# EAGLE schematic RF08-1 (EAGLE 6.6.0)

## Sheet 1 of 3
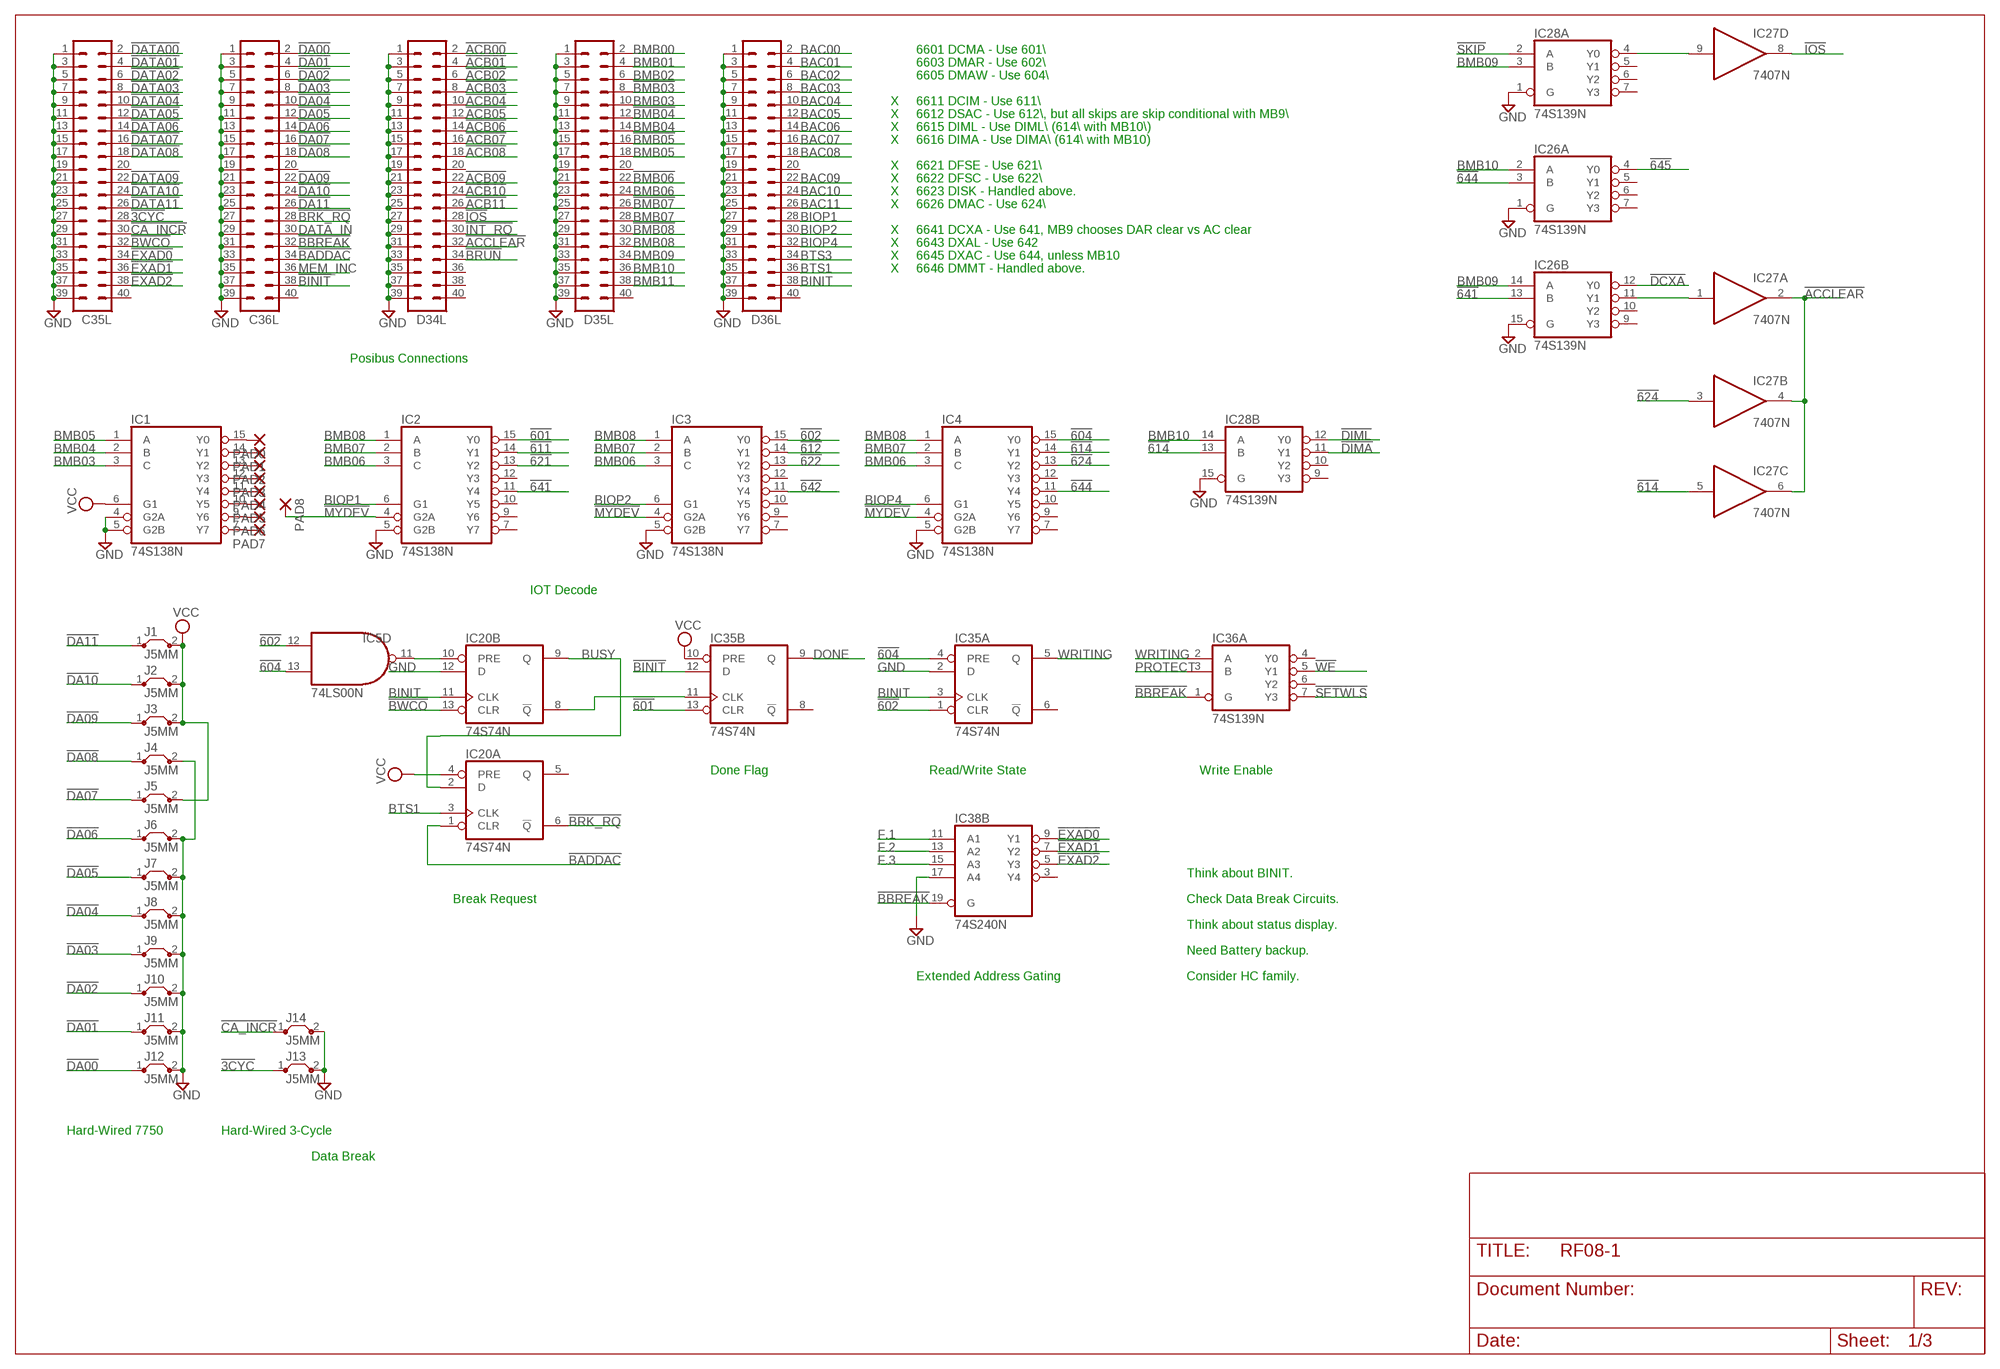
[diagram p0: schematic, sheet 1]

### Parts
C35L  MA20-2  [MA20-2]
C36L  MA20-2  [MA20-2]
D34L  MA20-2  [MA20-2]
D35L  MA20-2  [MA20-2]
D36L  MA20-2  [MA20-2]
IC1  74S138N  [DIL16]
IC2  74S138N  [DIL16]
IC3  74S138N  [DIL16]
IC4  74S138N  [DIL16]
IC5  74LS00N  [DIL14]
IC20  74S74N  [DIL14]
IC26  74S139N  [DIL16]
IC27  7407N  [DIL14]
IC28  74S139N  [DIL16]
IC35  74S74N  [DIL14]
IC36  74S139N  [DIL16]
IC38  74S240N  [DIL20]
J1  J5MM  [05]
J2  J5MM  [05]
J3  J5MM  [05]
J4  J5MM  [05]
J5  J5MM  [05]
J6  J5MM  [05]
J7  J5MM  [05]
J8  J5MM  [05]
J9  J5MM  [05]
J10  J5MM  [05]
J11  J5MM  [05]
J12  J5MM  [05]
J13  J5MM  [05]
J14  J5MM  [05]
PAD0  1,6/0,8  [1,6/0,8]
PAD1  1,6/0,8  [1,6/0,8]
PAD2  1,6/0,8  [1,6/0,8]
PAD3  1,6/0,8  [1,6/0,8]
PAD4  1,6/0,8  [1,6/0,8]
PAD5  1,6/0,8  [1,6/0,8]
PAD6  1,6/0,8  [1,6/0,8]
PAD7  1,6/0,8  [1,6/0,8]
PAD8  1,6/0,8  [1,6/0,8]

### Nets
!3CYC: C35L.28 J13.1
!601: IC2.15(Y0) IC35.13(B:CLR) ; also sheet 2
!602: IC3.15(Y0) IC5.12(D:I0) IC35.1(A:CLR) ; also sheet 2
!604: IC4.15(Y0) IC5.13(D:I1) IC35.4(A:PRE) ; also sheet 2
!611: IC2.14(Y1) ; also sheet 2
!612: IC3.14(Y1) ; also sheet 2
!614: IC4.14(Y1) IC27.5(C:I) IC28.13(B:B)
!621: IC2.13(Y2) ; also sheet 2
!622: IC3.13(Y2) ; also sheet 2
!624: IC4.13(Y2) IC27.3(B:I) ; also sheet 2
!641: IC2.11(Y4) IC26.13(B:B)
!642: IC3.11(Y4) ; also sheet 2
!644: IC4.11(Y4) IC26.3(A:B)
!645: IC26.4(A:Y0) ; also sheet 2
!ACB00: D34L.2 ; also sheet 2
!ACB01: D34L.4 ; also sheet 2
!ACB02: D34L.6 ; also sheet 2
!ACB03: D34L.8 ; also sheet 2
!ACB04: D34L.10 ; also sheet 2
!ACB05: D34L.12 ; also sheet 2
!ACB06: D34L.14 ; also sheet 2
!ACB07: D34L.16 ; also sheet 2
!ACB08: D34L.18 ; also sheet 2
!ACB09: D34L.22 ; also sheet 2
!ACB10: D34L.24 ; also sheet 2
!ACB11: D34L.26 ; also sheet 2
!ACCLEAR: D34L.32 IC27.2(A:O) IC27.4(B:O) IC27.6(C:O)
!BADDAC: C36L.34 IC20.1(A:CLR)
!BBREAK: C36L.32 IC36.1(A:G) IC38.19(B:G) ; also sheet 2,3
!BINIT: C36L.38 IC35.12(B:D)
!BMB03: D35L.8
!BMB04: D35L.12
!BMB05: D35L.16
!BMB06: D35L.22
!BMB07: D35L.26
!BMB08: D35L.30
!BRK_RQ: C36L.28 IC20.6(A:!Q)
!BRUN: D34L.34
!BWCO: C35L.32 IC20.13(B:CLR)
!CA_INCR: C35L.30 J14.1
!DA00: C36L.2 J12.1
!DA01: C36L.4 J11.1
!DA02: C36L.6 J10.1
!DA03: C36L.8 J9.1
!DA04: C36L.10 J8.1
!DA05: C36L.12 J7.1
!DA06: C36L.14 J6.1
!DA07: C36L.16 J5.1
!DA08: C36L.18 J4.1
!DA09: C36L.22 J3.1
!DA10: C36L.24 J2.1
!DA11: C36L.26 J1.1
!DATA00: C35L.2 ; also sheet 3
!DATA01: C35L.4 ; also sheet 3
!DATA02: C35L.6 ; also sheet 3
!DATA03: C35L.8 ; also sheet 3
!DATA04: C35L.10 ; also sheet 3
!DATA05: C35L.12 ; also sheet 3
!DATA06: C35L.14 ; also sheet 3
!DATA07: C35L.16 ; also sheet 3
!DATA08: C35L.18 ; also sheet 3
!DATA09: C35L.22 ; also sheet 3
!DATA10: C35L.24 ; also sheet 3
!DATA11: C35L.26 ; also sheet 3
!DCXA: IC26.12(B:Y0) ; also sheet 2
!DIMA: IC28.11(B:Y1) ; also sheet 2
!DIML: IC28.12(B:Y0) ; also sheet 2
!EXAD0: C35L.34 IC38.9(B:Y1)
!EXAD1: C35L.36 IC38.7(B:Y2)
!EXAD2: C35L.38 IC38.5(B:Y3)
!INT_RQ: D34L.30 ; also sheet 2
!IOS: D34L.28 IC27.8(D:O)
!MYDEV: IC2.4(G2A) IC3.4(G2A) IC4.4(G2A) PAD8.1(P)
!SETWLS: IC36.7(A:Y3) ; also sheet 2
!SKIP: IC28.2(A:A) ; also sheet 2
!WE: IC36.5(A:Y1) ; also sheet 3
BAC00: D36L.2 ; also sheet 2
BAC01: D36L.4 ; also sheet 2
BAC02: D36L.6 ; also sheet 2
BAC03: D36L.8 ; also sheet 2
BAC04: D36L.10 ; also sheet 2
BAC05: D36L.12 ; also sheet 2
BAC06: D36L.14 ; also sheet 2
BAC07: D36L.16 ; also sheet 2
BAC08: D36L.18 ; also sheet 2
BAC09: D36L.22 ; also sheet 2
BAC10: D36L.24 ; also sheet 2
BAC11: D36L.26 ; also sheet 2
BINIT: D36L.38 IC20.11(B:CLK) IC35.3(A:CLK) ; also sheet 2
BIOP1: D36L.28 IC2.6(G1)
BIOP2: D36L.30 IC3.6(G1)
BIOP4: D36L.32 IC4.6(G1)
BMB00: D35L.2 ; also sheet 3
BMB01: D35L.4 ; also sheet 3
BMB02: D35L.6 ; also sheet 3
BMB03: D35L.10 IC1.3(C) ; also sheet 3
BMB04: D35L.14 IC1.2(B) ; also sheet 3
BMB05: D35L.18 IC1.1(A) ; also sheet 3
BMB06: D35L.24 IC2.3(C) IC3.3(C) IC4.3(C) ; also sheet 3
BMB07: D35L.28 IC2.2(B) IC3.2(B) IC4.2(B) ; also sheet 3
BMB08: D35L.32 IC2.1(A) IC3.1(A) IC4.1(A) ; also sheet 3
BMB09: D35L.34 IC26.14(B:A) IC28.3(A:B) ; also sheet 3
BMB10: D35L.36 IC26.2(A:A) IC28.14(B:A) ; also sheet 3
BMB11: D35L.38 ; also sheet 3
BTS1: D36L.36 IC20.3(A:CLK)
BTS3: D36L.34
BUSY: IC20.2(A:D) IC20.9(B:Q) ; also sheet 2
DATA_IN: C36L.30
DONE: IC35.9(B:Q) ; also sheet 2
F.1: IC38.11(B:A1) ; also sheet 2
F.2: IC38.13(B:A2) ; also sheet 2
F.3: IC38.15(B:A3) ; also sheet 2
GND [Power]: C35L.1 C35L.3 C35L.5 C35L.7 C35L.9 C35L.11 C35L.13 C35L.15 C35L.17 C35L.19 C35L.21 C35L.23 C35L.25 C35L.27 C35L.29 C35L.31 C35L.33 C35L.35 C35L.37 C35L.39 C36L.1 C36L.3 C36L.5 C36L.7 C36L.9 C36L.11 C36L.13 C36L.15 C36L.17 C36L.19 C36L.21 C36L.23 C36L.25 C36L.27 C36L.29 C36L.31 C36L.33 C36L.35 C36L.37 C36L.39 D34L.1 D34L.3 D34L.5 D34L.7 D34L.9 D34L.11 D34L.13 D34L.15 D34L.17 D34L.19 D34L.21 D34L.23 D34L.25 D34L.27 D34L.29 D34L.31 D34L.33 D34L.35 D34L.37 D34L.39 D35L.1 D35L.3 D35L.5 D35L.7 D35L.9 D35L.11 D35L.13 D35L.15 D35L.17 D35L.19 D35L.21 D35L.23 D35L.25 D35L.27 D35L.29 D35L.31 D35L.33 D35L.35 D35L.37 D35L.39 D36L.1 D36L.3 D36L.5 D36L.7 D36L.9 D36L.11 D36L.13 D36L.15 D36L.17 D36L.19 D36L.21 D36L.23 D36L.25 D36L.27 D36L.29 D36L.31 D36L.33 D36L.35 D36L.37 D36L.39 IC1.4(G2A) IC1.5(G2B) IC2.5(G2B) IC3.5(G2B) IC4.5(G2B) IC20.12(B:D) IC26.1(A:G) IC26.15(B:G) IC28.1(A:G) IC28.15(B:G) IC35.2(A:D) IC38.17(B:A4) J4.2 J6.2 J7.2 J8.2 J9.2 J10.2 J11.2 J12.2 J13.2 J14.2 ; also sheet 2,3
MEM_INC: C36L.36
N$1: IC1.9(Y6) PAD6.1(P)
N$2: IC20.8(B:!Q) IC35.11(B:CLK)
N$5: IC1.15(Y0) PAD0.1(P)
N$6: IC1.14(Y1) PAD1.1(P)
N$7: IC1.13(Y2) PAD2.1(P)
N$8: IC1.12(Y3) PAD3.1(P)
N$9: IC1.11(Y4) PAD4.1(P)
N$10: IC1.10(Y5) PAD5.1(P)
N$11: IC1.7(Y7) PAD7.1(P)
N$26: IC26.11(B:Y1) IC27.1(A:I)
N$27: IC27.9(D:I) IC28.4(A:Y0)
N$31: IC5.11(D:O) IC20.10(B:PRE)
PROTECT: IC36.3(A:B) ; also sheet 3
VCC [Power]: IC1.6(G1) IC20.4(A:PRE) IC35.10(B:PRE) J1.2 J2.2 J3.2 J5.2 ; also sheet 2,3
WRITING: IC35.5(A:Q) IC36.2(A:A) ; also sheet 3
Unconnected: C35L.20 C35L.40 C36L.20 C36L.40 D34L.20 D34L.36 D34L.38 D34L.40 D35L.20 D35L.40 D36L.20 D36L.40 IC2.7(Y7) IC2.9(Y6) IC2.10(Y5) IC2.12(Y3) IC3.7(Y7) IC3.9(Y6) IC3.10(Y5) IC3.12(Y3) IC4.7(Y7) IC4.9(Y6) IC4.10(Y5) IC4.12(Y3) IC20.5(A:Q) IC26.5(A:Y1) IC26.6(A:Y2) IC26.7(A:Y3) IC26.9(B:Y3) IC26.10(B:Y2) IC27.10(E:O) IC27.11(E:I) IC27.12(F:O) IC27.13(F:I) IC28.5(A:Y1) IC28.6(A:Y2) IC28.7(A:Y3) IC28.9(B:Y3) IC28.10(B:Y2) IC35.6(A:!Q) IC35.8(B:!Q) IC36.4(A:Y0) IC36.6(A:Y2) IC36.9(B:Y3) IC36.10(B:Y2) IC36.11(B:Y1) IC36.12(B:Y0) IC36.13(B:B) IC36.14(B:A) IC36.15(B:G) IC38.1(A:G) IC38.2(A:A1) IC38.3(B:Y4) IC38.4(A:A2) IC38.6(A:A3) IC38.8(A:A4) IC38.12(A:Y4) IC38.14(A:Y3) IC38.16(A:Y2) IC38.18(A:Y1)

### Notes on the sheet
- 6601 DCMA - Use 601\\
- 6603 DMAR - Use 602\\
- 6605 DMAW - Use 604\\
- X | 6611 DCIM - Use 611\\
- X | 6612 DSAC - Use 612\\, but all skips are skip conditional with MB9\\
- X | 6615 DIML - Use DIML\\ (614\\ with MB10\\)
- X | 6616 DIMA - Use DIMA\\ (614\\ with MB10)
- X | 6621 DFSE - Use 621\\
- X | 6622 DFSC - Use 622\\
- X | 6623 DISK - Handled above.
- X | 6626 DMAC - Use 624\\
- X | 6641 DCXA - Use 641, MB9 chooses DAR clear vs AC clear
- X | 6643 DXAL - Use 642
- X | 6645 DXAC - Use 644, unless MB10
- X | 6646 DMMT - Handled above.
- Posibus Connections
- IOT Decode
- Done Flag | Read/Write State | Write Enable
- Think about BINIT.
- Break Request | Check Data Break Circuits.
- Think about status display.
- Need Battery backup.
- Extended Address Gating | Consider HC family.
- Hard-Wired 7750 | Hard-Wired 3-Cycle
- Data Break

## Sheet 2 of 3
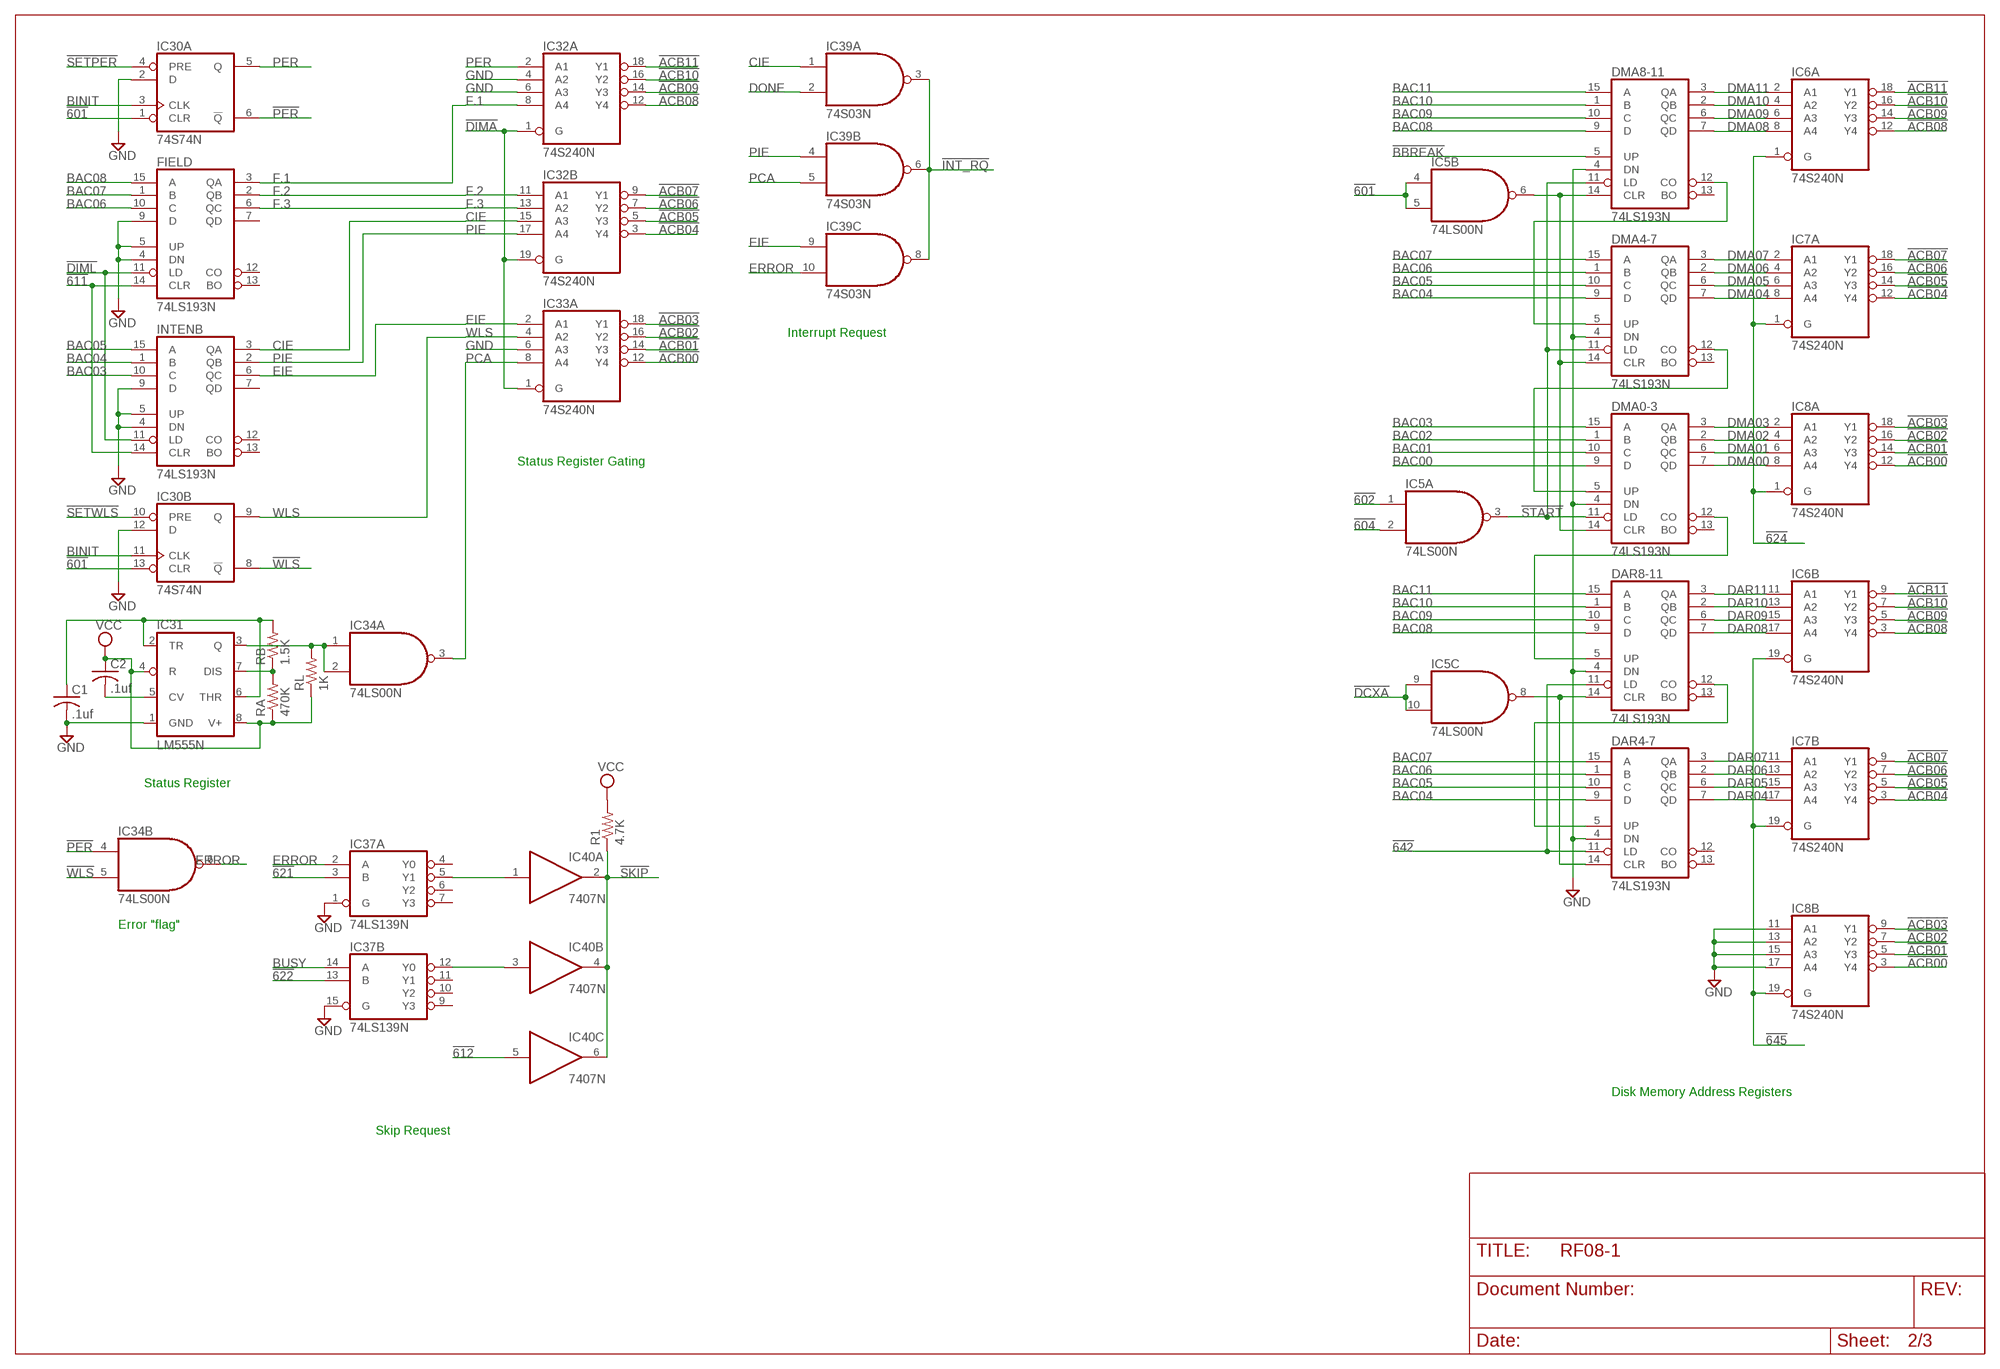
[diagram p1: schematic, sheet 2]

### Parts
C1  .1uf  C-US050-025X075  [C050-025X075]
C2  .1uf  C-US050-025X075  [C050-025X075]
DAR4-7  74LS193N  74LS192N  [DIL16]
DAR8-11  74LS193N  74LS192N  [DIL16]
DMA0-3  74LS193N  74LS192N  [DIL16]
DMA4-7  74LS193N  74LS192N  [DIL16]
DMA8-11  74LS193N  74LS192N  [DIL16]
FIELD  74LS193N  74LS192N  [DIL16]
IC6  74S240N  [DIL20]
IC7  74S240N  [DIL20]
IC8  74S240N  [DIL20]
IC30  74S74N  [DIL14]
IC31  LM555N  [DIL08]
IC32  74S240N  [DIL20]
IC33  74S240N  [DIL20]
IC34  74LS00N  [DIL14]
IC37  74LS139N  [DIL16]
IC39  74S03N  [DIL14]
IC40  7407N  [DIL14]
INTENB  74LS193N  74LS192N  [DIL16]
R1  4.7K  R-US_0207/10  [0207/10]
RA  470K  R-US_0207/10  [0207/10]
RB  1.5K  R-US_0207/10  [0207/10]
RL  1K  R-US_0207/10  [0207/10]

### Nets
!601: IC5.4(B:I0) IC5.5(B:I1) IC30.1(A:CLR) IC30.13(B:CLR) ; also sheet 1
!602: IC5.1(A:I0) ; also sheet 1
!604: IC5.2(A:I1) ; also sheet 1
!611: FIELD.14(CLR) INTENB.14(CLR) ; also sheet 1
!612: IC40.5(C:I) ; also sheet 1
!621: IC37.3(A:B) ; also sheet 1
!622: IC37.13(B:B) ; also sheet 1
!624: IC6.1(A:G) IC7.1(A:G) IC8.1(A:G) ; also sheet 1
!642: DAR4-7.11(LD) DAR8-11.11(LD) ; also sheet 1
!645: IC6.19(B:G) IC7.19(B:G) IC8.19(B:G) ; also sheet 1
!ACB00: IC8.3(B:Y4) IC8.12(A:Y4) IC33.12(A:Y4) ; also sheet 1
!ACB01: IC8.5(B:Y3) IC8.14(A:Y3) IC33.14(A:Y3) ; also sheet 1
!ACB02: IC8.7(B:Y2) IC8.16(A:Y2) IC33.16(A:Y2) ; also sheet 1
!ACB03: IC8.9(B:Y1) IC8.18(A:Y1) IC33.18(A:Y1) ; also sheet 1
!ACB04: IC7.3(B:Y4) IC7.12(A:Y4) IC32.3(B:Y4) ; also sheet 1
!ACB05: IC7.5(B:Y3) IC7.14(A:Y3) IC32.5(B:Y3) ; also sheet 1
!ACB06: IC7.7(B:Y2) IC7.16(A:Y2) IC32.7(B:Y2) ; also sheet 1
!ACB07: IC7.9(B:Y1) IC7.18(A:Y1) IC32.9(B:Y1) ; also sheet 1
!ACB08: IC6.3(B:Y4) IC6.12(A:Y4) IC32.12(A:Y4) ; also sheet 1
!ACB09: IC6.5(B:Y3) IC6.14(A:Y3) IC32.14(A:Y3) ; also sheet 1
!ACB10: IC6.7(B:Y2) IC6.16(A:Y2) IC32.16(A:Y2) ; also sheet 1
!ACB11: IC6.9(B:Y1) IC6.18(A:Y1) IC32.18(A:Y1) ; also sheet 1
!BBREAK: DMA8-11.5(UP) ; also sheet 1,3
!DCXA: IC5.9(C:I0) IC5.10(C:I1) ; also sheet 1
!DIMA: IC32.1(A:G) IC32.19(B:G) IC33.1(A:G) ; also sheet 1
!DIML: FIELD.11(LD) INTENB.11(LD) ; also sheet 1
!INT_RQ: IC39.3(A:O) IC39.6(B:O) IC39.8(C:O) ; also sheet 1
!PER: IC30.6(A:!Q) IC34.4(B:I0)
!SETPER: IC30.4(A:PRE) ; also sheet 3
!SETWLS: IC30.10(B:PRE) ; also sheet 1
!SKIP: IC40.2(A:O) IC40.4(B:O) IC40.6(C:O) R1.1 ; also sheet 1
!START: DMA0-3.11(LD) DMA4-7.11(LD) DMA8-11.11(LD) IC5.3(A:O)
!WLS: IC30.8(B:!Q) IC34.5(B:I1)
BAC00: DMA0-3.9(D) ; also sheet 1
BAC01: DMA0-3.10(C) ; also sheet 1
BAC02: DMA0-3.1(B) ; also sheet 1
BAC03: DMA0-3.15(A) INTENB.10(C) ; also sheet 1
BAC04: DAR4-7.9(D) DMA4-7.9(D) INTENB.1(B) ; also sheet 1
BAC05: DAR4-7.10(C) DMA4-7.10(C) INTENB.15(A) ; also sheet 1
BAC06: DAR4-7.1(B) DMA4-7.1(B) FIELD.10(C) ; also sheet 1
BAC07: DAR4-7.15(A) DMA4-7.15(A) FIELD.1(B) ; also sheet 1
BAC08: DAR8-11.9(D) DMA8-11.9(D) FIELD.15(A) ; also sheet 1
BAC09: DAR8-11.10(C) DMA8-11.10(C) ; also sheet 1
BAC10: DAR8-11.1(B) DMA8-11.1(B) ; also sheet 1
BAC11: DAR8-11.15(A) DMA8-11.15(A) ; also sheet 1
BINIT: IC30.3(A:CLK) IC30.11(B:CLK) ; also sheet 1
BUSY: IC37.14(B:A) ; also sheet 1
CIE: IC32.15(B:A3) IC39.1(A:I0) INTENB.3(QA)
DAR04: DAR4-7.7(QD) IC7.17(B:A4) ; also sheet 3
DAR05: DAR4-7.6(QC) IC7.15(B:A3) ; also sheet 3
DAR06: DAR4-7.2(QB) IC7.13(B:A2) ; also sheet 3
DAR07: DAR4-7.3(QA) IC7.11(B:A1) ; also sheet 3
DAR08: DAR8-11.7(QD) IC6.17(B:A4) ; also sheet 3
DAR09: DAR8-11.6(QC) IC6.15(B:A3) ; also sheet 3
DAR10: DAR8-11.2(QB) IC6.13(B:A2) ; also sheet 3
DAR11: DAR8-11.3(QA) IC6.11(B:A1) ; also sheet 3
DMA00: DMA0-3.7(QD) IC8.8(A:A4) ; also sheet 3
DMA01: DMA0-3.6(QC) IC8.6(A:A3) ; also sheet 3
DMA02: DMA0-3.2(QB) IC8.4(A:A2) ; also sheet 3
DMA03: DMA0-3.3(QA) IC8.2(A:A1) ; also sheet 3
DMA04: DMA4-7.7(QD) IC7.8(A:A4) ; also sheet 3
DMA05: DMA4-7.6(QC) IC7.6(A:A3) ; also sheet 3
DMA06: DMA4-7.2(QB) IC7.4(A:A2) ; also sheet 3
DMA07: DMA4-7.3(QA) IC7.2(A:A1) ; also sheet 3
DMA08: DMA8-11.7(QD) IC6.8(A:A4) ; also sheet 3
DMA09: DMA8-11.6(QC) IC6.6(A:A3) ; also sheet 3
DMA10: DMA8-11.2(QB) IC6.4(A:A2) ; also sheet 3
DMA11: DMA8-11.3(QA) IC6.2(A:A1) ; also sheet 3
DONE: IC39.2(A:I1) ; also sheet 1
EIE: IC33.2(A:A1) IC39.9(C:I0) INTENB.6(QC)
ERROR: IC34.6(B:O) IC37.2(A:A) IC39.10(C:I1)
F.1: FIELD.3(QA) IC32.8(A:A4) ; also sheet 1
F.2: FIELD.2(QB) IC32.11(B:A1) ; also sheet 1
F.3: FIELD.6(QC) IC32.13(B:A2) ; also sheet 1
GND [Power]: C1.2 DAR4-7.4(DN) DAR8-11.4(DN) DMA0-3.4(DN) DMA4-7.4(DN) DMA8-11.4(DN) FIELD.4(DN) FIELD.5(UP) FIELD.9(D) IC8.11(B:A1) IC8.13(B:A2) IC8.15(B:A3) IC8.17(B:A4) IC30.2(A:D) IC30.12(B:D) IC31.1(GND) IC32.4(A:A2) IC32.6(A:A3) IC33.6(A:A3) IC37.1(A:G) IC37.15(B:G) INTENB.4(DN) INTENB.5(UP) INTENB.9(D) ; also sheet 1,3
N$3: DMA0-3.5(UP) DMA4-7.12(CO)
N$12: DAR4-7.14(CLR) DAR8-11.14(CLR) IC5.8(C:O)
N$13: DMA4-7.5(UP) DMA8-11.12(CO)
N$16: DAR8-11.5(UP) DMA0-3.12(CO)
N$22: DMA0-3.14(CLR) DMA4-7.14(CLR) DMA8-11.14(CLR) IC5.6(B:O)
N$25: DAR4-7.5(UP) DAR8-11.12(CO)
N$28: IC37.5(A:Y1) IC40.1(A:I)
N$29: IC31.7(DIS) RA.2 RB.1
N$30: IC31.3(Q) IC34.1(A:I0) IC34.2(A:I1) RL.2
N$32: C1.1 IC31.2(TR) IC31.6(THR) RB.2
N$33: IC37.12(B:Y0) IC40.3(B:I)
N$34: C2.2 IC31.5(CV)
PCA: IC33.8(A:A4) IC34.3(A:O) IC39.5(B:I1)
PER: IC30.5(A:Q) IC32.2(A:A1)
PIE: IC32.17(B:A4) IC39.4(B:I0) INTENB.2(QB)
VCC [Power]: C2.1 IC31.4(R) IC31.8(V+) R1.2 RA.1 RL.1 ; also sheet 1,3
WLS: IC30.9(B:Q) IC33.4(A:A2)
Unconnected: DAR4-7.12(CO) DAR4-7.13(BO) DAR8-11.13(BO) DMA0-3.13(BO) DMA4-7.13(BO) DMA8-11.13(BO) FIELD.7(QD) FIELD.12(CO) FIELD.13(BO) IC33.3(B:Y4) IC33.5(B:Y3) IC33.7(B:Y2) IC33.9(B:Y1) IC33.11(B:A1) IC33.13(B:A2) IC33.15(B:A3) IC33.17(B:A4) IC33.19(B:G) IC34.8(C:O) IC34.9(C:I0) IC34.10(C:I1) IC34.11(D:O) IC34.12(D:I0) IC34.13(D:I1) IC37.4(A:Y0) IC37.6(A:Y2) IC37.7(A:Y3) IC37.9(B:Y3) IC37.10(B:Y2) IC37.11(B:Y1) IC39.11(D:O) IC39.12(D:I0) IC39.13(D:I1) IC40.8(D:O) IC40.9(D:I) IC40.10(E:O) IC40.11(E:I) IC40.12(F:O) IC40.13(F:I) INTENB.7(QD) INTENB.12(CO) INTENB.13(BO)

### Notes on the sheet
- Interrupt Request
- Status Register Gating
- Status Register
- Error "flag"
- Disk Memory Address Registers
- Skip Request

## Sheet 3 of 3
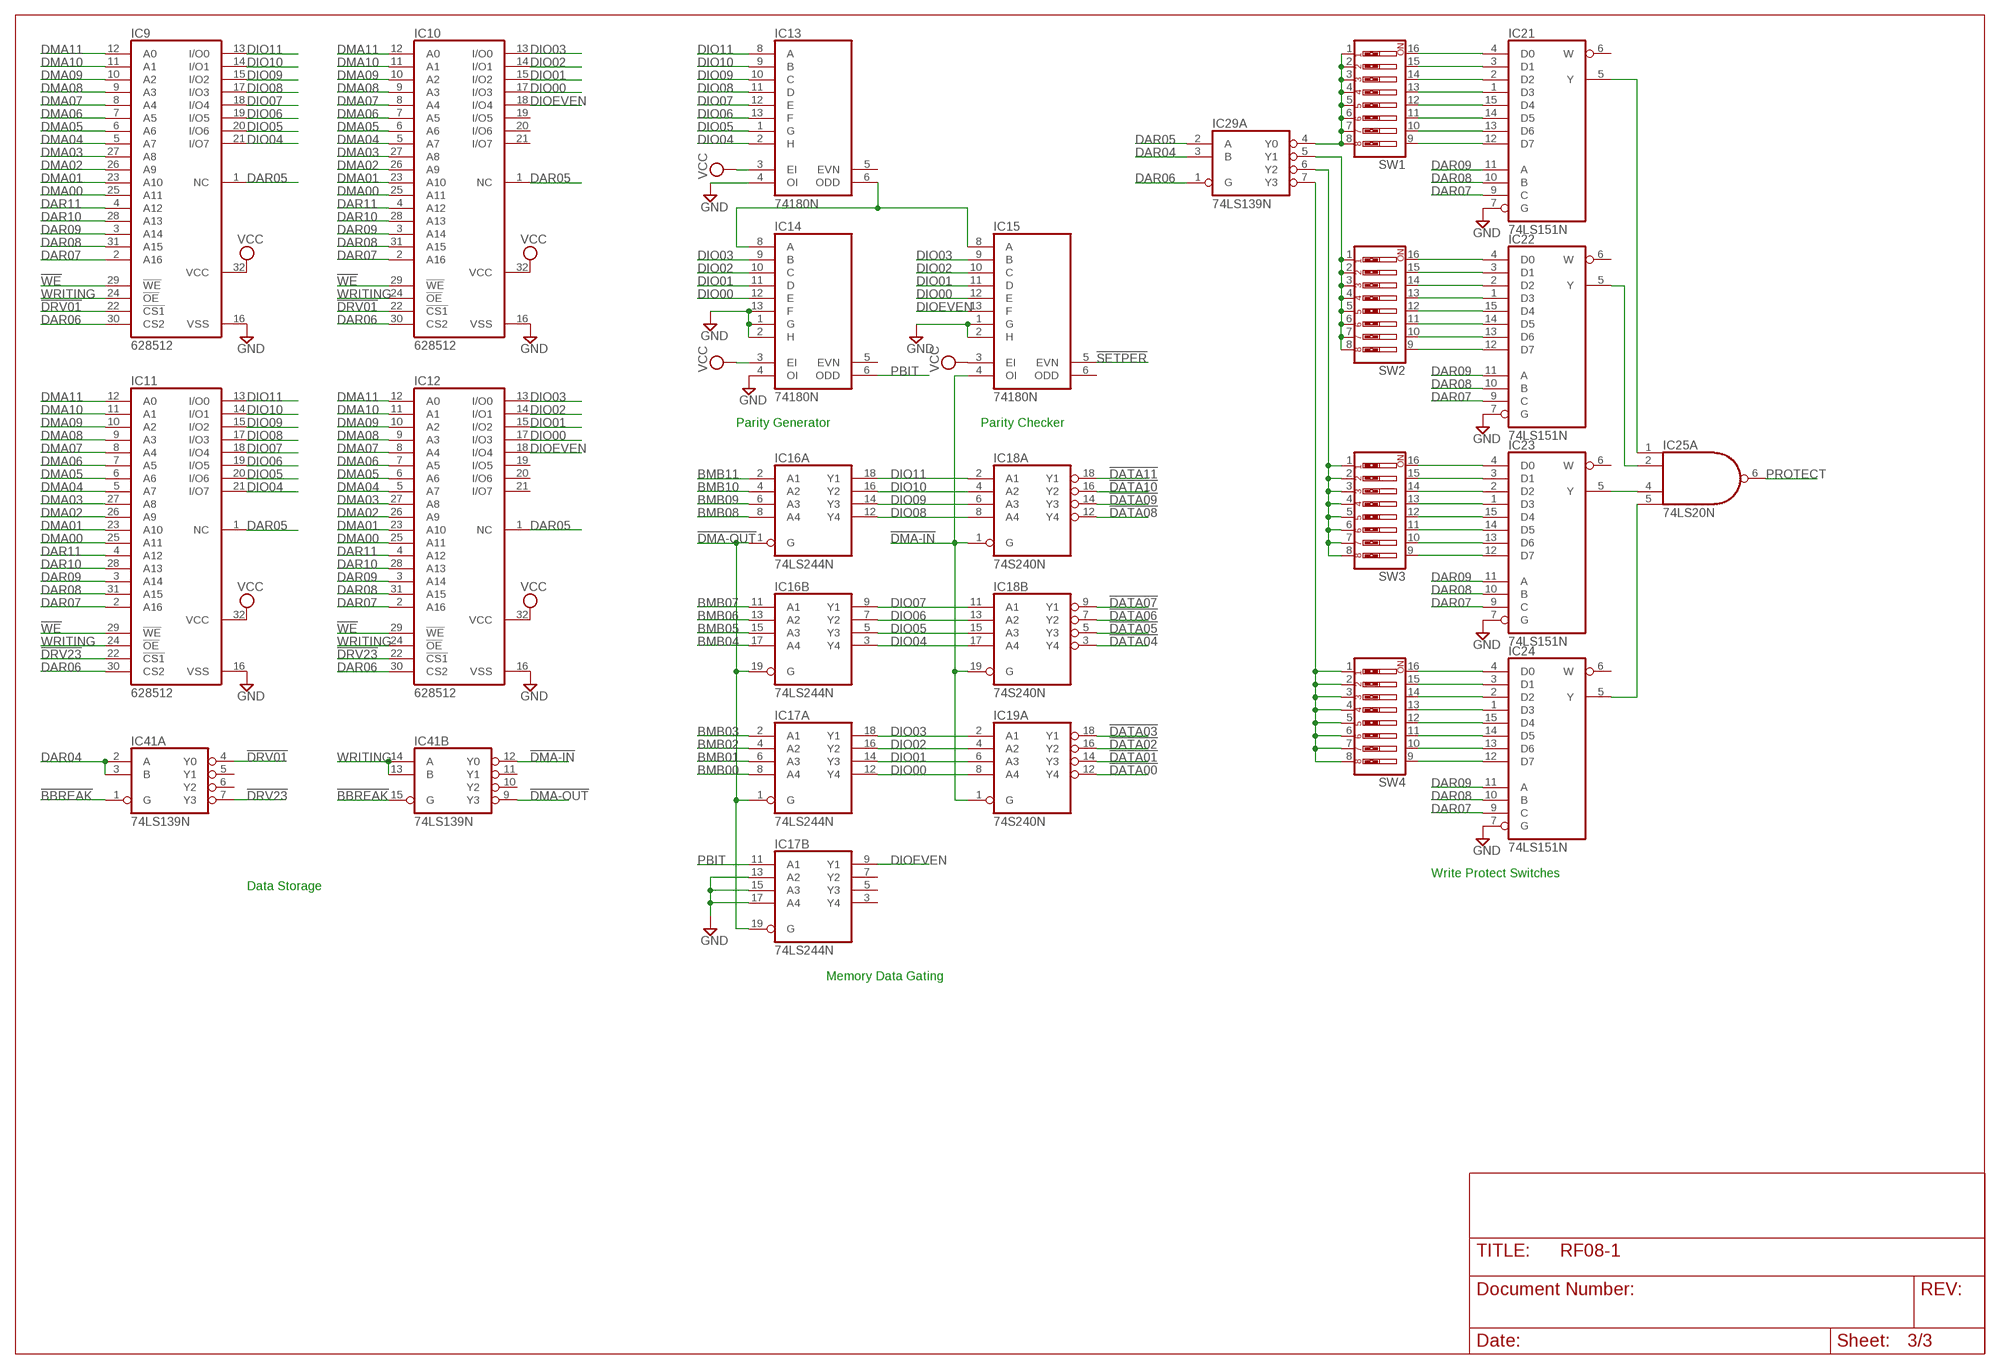
[diagram p2: schematic, sheet 3]

### Parts
IC9  628512  628128P  [DIL32]
IC10  628512  628128P  [DIL32]
IC11  628512  628128P  [DIL32]
IC12  628512  628128P  [DIL32]
IC13  74180N  [DIL14]
IC14  74180N  [DIL14]
IC15  74180N  [DIL14]
IC16  74LS244N  [DIL20]
IC17  74LS244N  [DIL20]
IC18  74S240N  [DIL20]
IC19  74S240N  [DIL20]
IC21  74LS151N  [DIL16]
IC22  74LS151N  [DIL16]
IC23  74LS151N  [DIL16]
IC24  74LS151N  [DIL16]
IC25  74LS20N  [DIL14]
IC29  74LS139N  [DIL16]
IC41  74LS139N  [DIL16]
SW1  SW_DIP-8  [EDG-08]
SW2  SW_DIP-8  [EDG-08]
SW3  SW_DIP-8  [EDG-08]
SW4  SW_DIP-8  [EDG-08]

### Nets
!BBREAK: IC41.1(A:G) IC41.15(B:G) ; also sheet 1,2
!DATA00: IC19.12(A:Y4) ; also sheet 1
!DATA01: IC19.14(A:Y3) ; also sheet 1
!DATA02: IC19.16(A:Y2) ; also sheet 1
!DATA03: IC19.18(A:Y1) ; also sheet 1
!DATA04: IC18.3(B:Y4) ; also sheet 1
!DATA05: IC18.5(B:Y3) ; also sheet 1
!DATA06: IC18.7(B:Y2) ; also sheet 1
!DATA07: IC18.9(B:Y1) ; also sheet 1
!DATA08: IC18.12(A:Y4) ; also sheet 1
!DATA09: IC18.14(A:Y3) ; also sheet 1
!DATA10: IC18.16(A:Y2) ; also sheet 1
!DATA11: IC18.18(A:Y1) ; also sheet 1
!DMA-IN: IC15.4(OI) IC18.1(A:G) IC18.19(B:G) IC19.1(A:G) IC41.12(B:Y0)
!DMA-OUT: IC16.1(A:G) IC16.19(B:G) IC17.1(A:G) IC17.19(B:G) IC41.9(B:Y3)
!DRV01: IC9.22(!CS1) IC10.22(!CS1) IC41.4(A:Y0)
!DRV23: IC11.22(!CS1) IC12.22(!CS1) IC41.7(A:Y3)
!SETPER: IC15.5(EVN) ; also sheet 2
!WE: IC9.29(!WE) IC10.29(!WE) IC11.29(!WE) IC12.29(!WE) ; also sheet 1
BMB00: IC17.8(A:A4) ; also sheet 1
BMB01: IC17.6(A:A3) ; also sheet 1
BMB02: IC17.4(A:A2) ; also sheet 1
BMB03: IC17.2(A:A1) ; also sheet 1
BMB04: IC16.17(B:A4) ; also sheet 1
BMB05: IC16.15(B:A3) ; also sheet 1
BMB06: IC16.13(B:A2) ; also sheet 1
BMB07: IC16.11(B:A1) ; also sheet 1
BMB08: IC16.8(A:A4) ; also sheet 1
BMB09: IC16.6(A:A3) ; also sheet 1
BMB10: IC16.4(A:A2) ; also sheet 1
BMB11: IC16.2(A:A1) ; also sheet 1
DAR04: IC29.3(A:B) IC41.2(A:A) IC41.3(A:B) ; also sheet 2
DAR05: IC9.1(NC) IC10.1(NC) IC11.1(NC) IC12.1(NC) IC29.2(A:A) ; also sheet 2
DAR06: IC9.30(CS2) IC10.30(CS2) IC11.30(CS2) IC12.30(CS2) IC29.1(A:G) ; also sheet 2
DAR07: IC9.2(A16) IC10.2(A16) IC11.2(A16) IC12.2(A16) IC21.9(C) IC22.9(C) IC23.9(C) IC24.9(C) ; also sheet 2
DAR08: IC9.31(A15) IC10.31(A15) IC11.31(A15) IC12.31(A15) IC21.10(B) IC22.10(B) IC23.10(B) IC24.10(B) ; also sheet 2
DAR09: IC9.3(A14) IC10.3(A14) IC11.3(A14) IC12.3(A14) IC21.11(A) IC22.11(A) IC23.11(A) IC24.11(A) ; also sheet 2
DAR10: IC9.28(A13) IC10.28(A13) IC11.28(A13) IC12.28(A13) ; also sheet 2
DAR11: IC9.4(A12) IC10.4(A12) IC11.4(A12) IC12.4(A12) ; also sheet 2
DIO00: IC10.17(I/O3) IC12.17(I/O3) IC14.12(E) IC15.12(E) IC17.12(A:Y4) IC19.8(A:A4)
DIO01: IC10.15(I/O2) IC12.15(I/O2) IC14.11(D) IC15.11(D) IC17.14(A:Y3) IC19.6(A:A3)
DIO02: IC10.14(I/O1) IC12.14(I/O1) IC14.10(C) IC15.10(C) IC17.16(A:Y2) IC19.4(A:A2)
DIO03: IC10.13(I/O0) IC12.13(I/O0) IC14.9(B) IC15.9(B) IC17.18(A:Y1) IC19.2(A:A1)
DIO04: IC9.21(I/O7) IC11.21(I/O7) IC13.2(H) IC16.3(B:Y4) IC18.17(B:A4)
DIO05: IC9.20(I/O6) IC11.20(I/O6) IC13.1(G) IC16.5(B:Y3) IC18.15(B:A3)
DIO06: IC9.19(I/O5) IC11.19(I/O5) IC13.13(F) IC16.7(B:Y2) IC18.13(B:A2)
DIO07: IC9.18(I/O4) IC11.18(I/O4) IC13.12(E) IC16.9(B:Y1) IC18.11(B:A1)
DIO08: IC9.17(I/O3) IC11.17(I/O3) IC13.11(D) IC16.12(A:Y4) IC18.8(A:A4)
DIO09: IC9.15(I/O2) IC11.15(I/O2) IC13.10(C) IC16.14(A:Y3) IC18.6(A:A3)
DIO10: IC9.14(I/O1) IC11.14(I/O1) IC13.9(B) IC16.16(A:Y2) IC18.4(A:A2)
DIO11: IC9.13(I/O0) IC11.13(I/O0) IC13.8(A) IC16.18(A:Y1) IC18.2(A:A1)
DIOEVEN: IC10.18(I/O4) IC12.18(I/O4) IC15.13(F) IC17.9(B:Y1)
DMA00: IC9.25(A11) IC10.25(A11) IC11.25(A11) IC12.25(A11) ; also sheet 2
DMA01: IC9.23(A10) IC10.23(A10) IC11.23(A10) IC12.23(A10) ; also sheet 2
DMA02: IC9.26(A9) IC10.26(A9) IC11.26(A9) IC12.26(A9) ; also sheet 2
DMA03: IC9.27(A8) IC10.27(A8) IC11.27(A8) IC12.27(A8) ; also sheet 2
DMA04: IC9.5(A7) IC10.5(A7) IC11.5(A7) IC12.5(A7) ; also sheet 2
DMA05: IC9.6(A6) IC10.6(A6) IC11.6(A6) IC12.6(A6) ; also sheet 2
DMA06: IC9.7(A5) IC10.7(A5) IC11.7(A5) IC12.7(A5) ; also sheet 2
DMA07: IC9.8(A4) IC10.8(A4) IC11.8(A4) IC12.8(A4) ; also sheet 2
DMA08: IC9.9(A3) IC10.9(A3) IC11.9(A3) IC12.9(A3) ; also sheet 2
DMA09: IC9.10(A2) IC10.10(A2) IC11.10(A2) IC12.10(A2) ; also sheet 2
DMA10: IC9.11(A1) IC10.11(A1) IC11.11(A1) IC12.11(A1) ; also sheet 2
DMA11: IC9.12(A0) IC10.12(A0) IC11.12(A0) IC12.12(A0) ; also sheet 2
GND [Power]: IC9.16(VSS) IC10.16(VSS) IC11.16(VSS) IC12.16(VSS) IC13.4(OI) IC14.1(G) IC14.2(H) IC14.4(OI) IC14.13(F) IC15.1(G) IC15.2(H) IC17.13(B:A2) IC17.15(B:A3) IC17.17(B:A4) IC21.7(G) IC22.7(G) IC23.7(G) IC24.7(G) ; also sheet 1,2
N$4: IC29.4(A:Y0) SW1.1 SW1.2 SW1.3 SW1.4 SW1.5 SW1.6 SW1.7 SW1.8
N$14: IC13.6(ODD) IC14.8(A) IC15.8(A)
N$15: IC22.5(Y) IC25.2(A:I1)
N$17: IC29.5(A:Y1) SW2.1 SW2.2 SW2.3 SW2.4 SW2.5 SW2.6 SW2.7 SW2.8
N$19: IC29.6(A:Y2) SW3.1 SW3.2 SW3.3 SW3.4 SW3.5 SW3.6 SW3.7 SW3.8
N$20: IC29.7(A:Y3) SW4.1 SW4.2 SW4.3 SW4.4 SW4.5 SW4.6 SW4.7 SW4.8
N$21: IC23.5(Y) IC25.4(A:I2)
N$23: IC21.5(Y) IC25.1(A:I0)
N$24: IC24.5(Y) IC25.5(A:I3)
N$53: IC21.4(D0) SW1.16
N$54: IC21.3(D1) SW1.15
N$55: IC21.2(D2) SW1.14
N$56: IC21.1(D3) SW1.13
N$57: IC21.14(D5) SW1.11
N$58: IC21.13(D6) SW1.10
N$59: IC21.12(D7) SW1.9
N$60: IC21.15(D4) SW1.12
N$61: IC22.4(D0) SW2.16
N$62: IC22.3(D1) SW2.15
N$63: IC22.2(D2) SW2.14
N$64: IC22.1(D3) SW2.13
N$65: IC22.14(D5) SW2.11
N$66: IC22.13(D6) SW2.10
N$67: IC22.12(D7) SW2.9
N$68: IC23.4(D0) SW3.16
N$69: IC23.3(D1) SW3.15
N$70: IC23.2(D2) SW3.14
N$71: IC23.1(D3) SW3.13
N$72: IC23.14(D5) SW3.11
N$73: IC23.13(D6) SW3.10
N$74: IC23.12(D7) SW3.9
N$75: IC24.4(D0) SW4.16
N$76: IC24.3(D1) SW4.15
N$77: IC24.2(D2) SW4.14
N$78: IC24.1(D3) SW4.13
N$79: IC24.14(D5) SW4.11
N$80: IC24.13(D6) SW4.10
N$81: IC24.12(D7) SW4.9
N$82: IC24.15(D4) SW4.12
N$83: IC23.15(D4) SW3.12
N$84: IC22.15(D4) SW2.12
PBIT: IC14.6(ODD) IC17.11(B:A1)
PROTECT: IC25.6(A:O) ; also sheet 1
VCC [Power]: IC9.32(VCC) IC10.32(VCC) IC11.32(VCC) IC12.32(VCC) IC13.3(EI) IC14.3(EI) IC15.3(EI) ; also sheet 1,2
WRITING: IC9.24(!OE) IC10.24(!OE) IC11.24(!OE) IC12.24(!OE) IC41.13(B:B) IC41.14(B:A) ; also sheet 1
Unconnected: IC10.19(I/O5) IC10.20(I/O6) IC10.21(I/O7) IC12.19(I/O5) IC12.20(I/O6) IC12.21(I/O7) IC13.5(EVN) IC14.5(EVN) IC15.6(ODD) IC17.3(B:Y4) IC17.5(B:Y3) IC17.7(B:Y2) IC19.3(B:Y4) IC19.5(B:Y3) IC19.7(B:Y2) IC19.9(B:Y1) IC19.11(B:A1) IC19.13(B:A2) IC19.15(B:A3) IC19.17(B:A4) IC19.19(B:G) IC21.6(W) IC22.6(W) IC23.6(W) IC24.6(W) IC25.8(B:O) IC25.9(B:I0) IC25.10(B:I1) IC25.12(B:I2) IC25.13(B:I3) IC29.9(B:Y3) IC29.10(B:Y2) IC29.11(B:Y1) IC29.12(B:Y0) IC29.13(B:B) IC29.14(B:A) IC29.15(B:G) IC41.5(A:Y1) IC41.6(A:Y2) IC41.10(B:Y2) IC41.11(B:Y1)

### Notes on the sheet
- Parity Generator | Parity Checker
- Write Protect Switches
- Data Storage
- Memory Data Gating

## Power pins joined to a net without a drawn wire
GND: DAR4-7.8(GND) DAR8-11.8(GND) DMA0-3.8(GND) DMA4-7.8(GND) DMA8-11.8(GND) FIELD.8(GND) IC1.8(GND) IC2.8(GND) IC3.8(GND) IC4.8(GND) IC5.7(P:GND) IC6.10(P:GND) IC7.10(P:GND) IC8.10(P:GND) IC13.7(GND) IC14.7(GND) IC15.7(GND) IC16.10(P:GND) IC17.10(P:GND) IC18.10(P:GND) IC19.10(P:GND) IC20.7(P:GND) IC21.8(GND) IC22.8(GND) IC23.8(GND) IC24.8(GND) IC25.7(P:GND) IC26.8(P:GND) IC27.7(P:GND) IC28.8(P:GND) IC29.8(P:GND) IC30.7(P:GND) IC32.10(P:GND) IC33.10(P:GND) IC34.7(P:GND) IC35.7(P:GND) IC36.8(P:GND) IC37.8(P:GND) IC38.10(P:GND) IC39.7(P:GND) IC40.7(P:GND) IC41.8(P:GND) INTENB.8(GND)
VCC: DAR4-7.16(VCC) DAR8-11.16(VCC) DMA0-3.16(VCC) DMA4-7.16(VCC) DMA8-11.16(VCC) FIELD.16(VCC) IC1.16(VCC) IC2.16(VCC) IC3.16(VCC) IC4.16(VCC) IC5.14(P:VCC) IC6.20(P:VCC) IC7.20(P:VCC) IC8.20(P:VCC) IC13.14(VCC) IC14.14(VCC) IC15.14(VCC) IC16.20(P:VCC) IC17.20(P:VCC) IC18.20(P:VCC) IC19.20(P:VCC) IC20.14(P:VCC) IC21.16(VCC) IC22.16(VCC) IC23.16(VCC) IC24.16(VCC) IC25.14(P:VCC) IC26.16(P:VCC) IC27.14(P:VCC) IC28.16(P:VCC) IC29.16(P:VCC) IC30.14(P:VCC) IC32.20(P:VCC) IC33.20(P:VCC) IC34.14(P:VCC) IC35.14(P:VCC) IC36.16(P:VCC) IC37.16(P:VCC) IC38.20(P:VCC) IC39.14(P:VCC) IC40.14(P:VCC) IC41.16(P:VCC) INTENB.16(VCC)

## Library data of the parts
C1 C2 = rcl:C-US: CAPACITOR, American symbol
C35L C36L D34L D35L D36L = con-lstb:MA20-2: PIN HEADER; OC_FARNELL: unknown; OC_NEWARK: unknown
DAR4-7 DAR8-11 DMA0-3 DMA4-7 DMA8-11 FIELD INTENB = 74xx-us:74*192: Synchronous 4-bit UP/DOWN COUNTER
IC1-IC4 = 74xx-us:74*138: 3-line to 8-line DECODER/DEMULTIPLEXER
IC5 IC34 = 74xx-us:74*00: Quad 2-input NAND gate
IC6-IC8 IC18 IC19 IC32 IC33 IC38 = 74xx-us:74*240: Octal BUFFER and LINE DRIVER, 3-state
IC9-IC12 = memory-hitachi:628128P: MEMORY; OC_FARNELL: unknown; OC_NEWARK: unknown
IC13-IC15 = 74xx-us:74*180: 9-bit odd/even PARITY GENERATOR/CHECKER
IC16 IC17 = 74xx-us:74*244: Octal BUFFER and LINE DRIVER, 3-state
IC20 IC30 IC35 = 74xx-us:74*74: Dual D type positive edge triggered FLIP FLOP, preset and clear
IC21-IC24 = 74xx-us:74*151: Data SELECTOR/MULTIPLEXER
IC25 = 74xx-us:74*20: Dual 4-input NAND gate
IC26 IC28 IC29 IC36 IC37 IC41 = 74xx-us:74*139: Dual 2-line to 4-line DECODER/DEMULTIPLEXER
IC27 IC40 = 74xx-us:74*07: Hex BUFFER, open collector high-voltage output
IC31 = linear:*555: TIMER
IC39 = 74xx-us:74*03: Quad 2-input NAND gate, open collector output
J1-J14 = jumper:J: Bridge
PAD0 PAD1-PAD8 = wirepad:1,6/0,8: THROUGH-HOLE PAD
R1 RA RB RL = rcl:R-US_: RESISTOR, American symbol
SW1-SW4 = special:SW_DIP-8: DIP SWITCH

## Net classes
1 Power: width 0.508 mm